# EAGLE schematic STM32L05C8T6 (EAGLE 9.6.2)
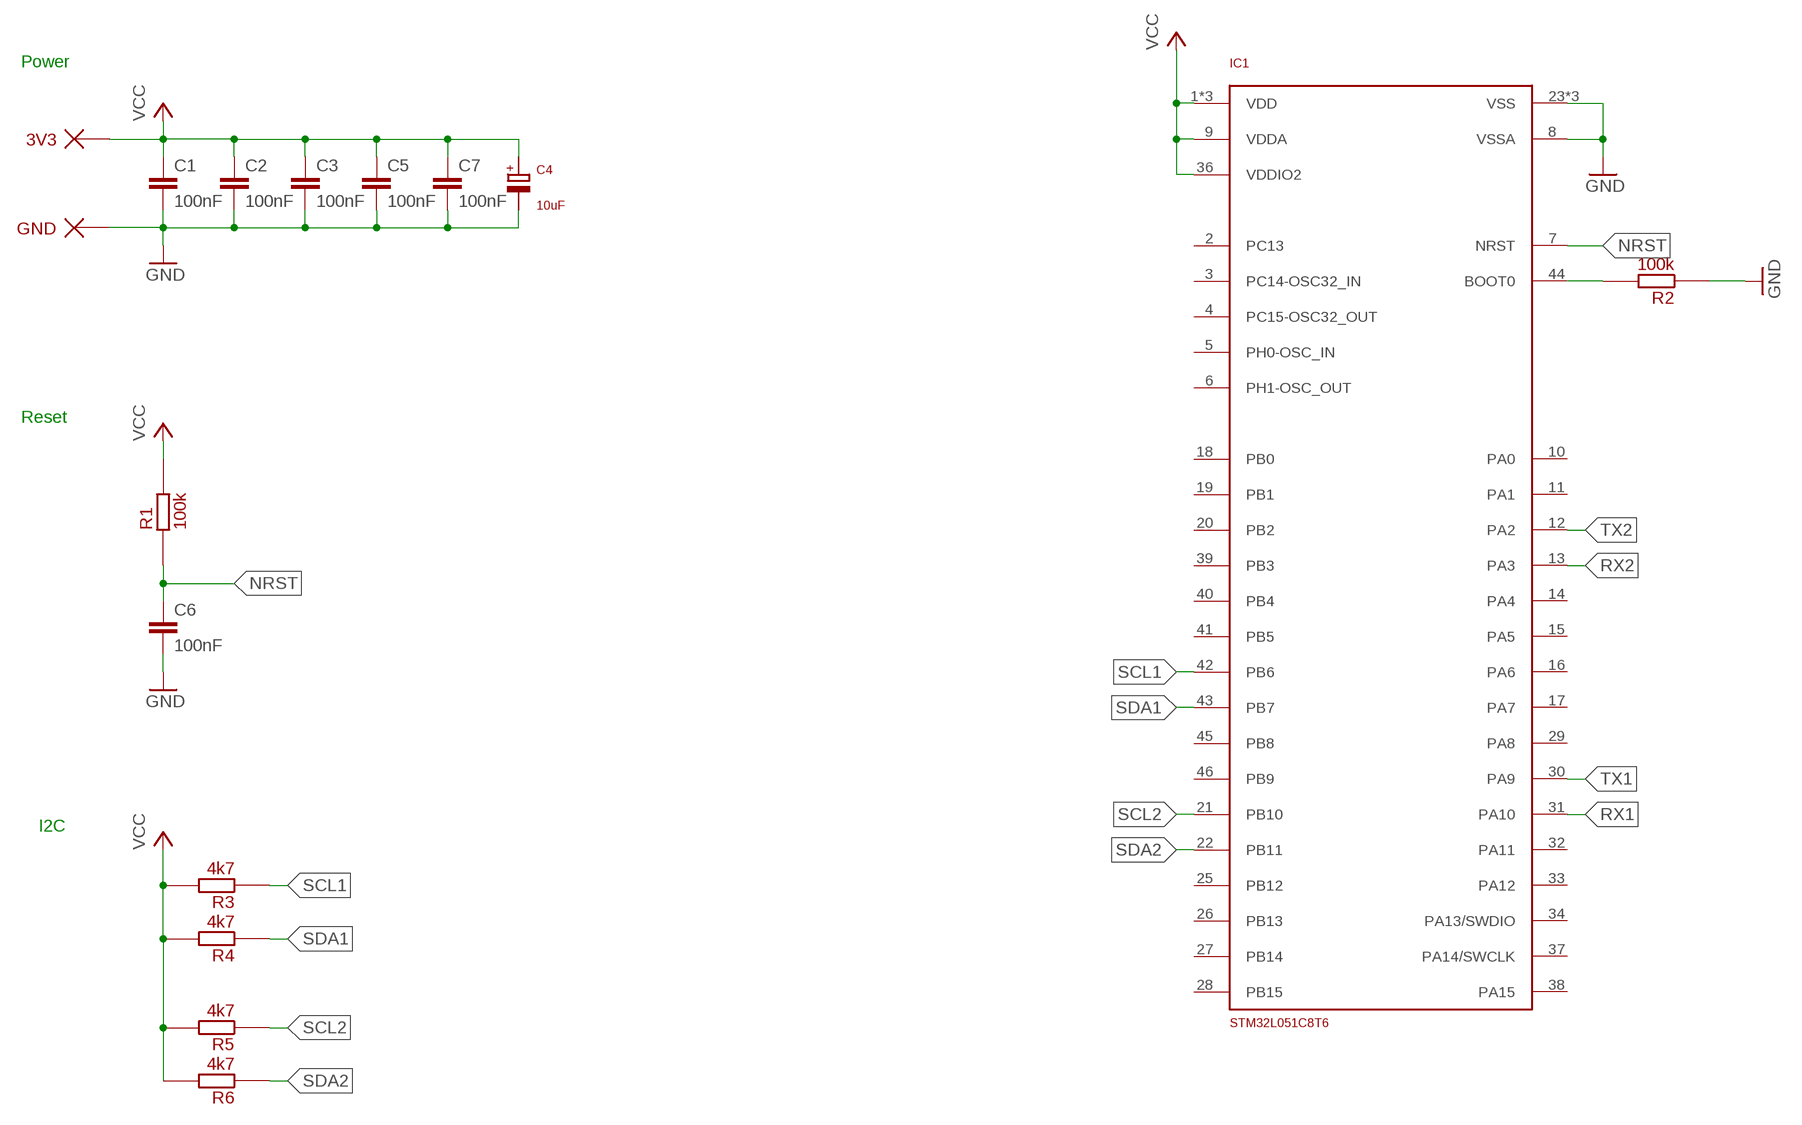
[diagram p0: schematic, sheet 1]

## Parts
C1  100nF  SMD-C-1206  [C1206]
C2  100nF  SMD-C-1206  [C1206]
C3  100nF  SMD-C-1206  [C1206]
C4  10uF  SMD-ELKOA5  [SANYO-OSCON_SMD_A5]
C5  100nF  SMD-C-1206  [C1206]
C6  100nF  SMD-C-1206  [C1206]
C7  100nF  SMD-C-1206  [C1206]
IC1  STM32L051C8T6  [TQFP48_7X7]
P1  3V3  PIN  [PIN]
P2  GND  PIN  [PIN]
R1  100k  SMD-RR0603  [R0603]
R2  100k  SMD-RR0603  [R0603]
R3  4k7  SMD-RR0603  [R0603]
R4  4k7  SMD-RR0603  [R0603]
R5  4k7  SMD-RR0603  [R0603]
R6  4k7  SMD-RR0603  [R0603]

## Nets
GND: C1.2 C2.2 C3.2 C4.- C5.2 C6.2 C7.2 IC1.8(VSSA) IC1.23(VSS) IC1.35(VSS) IC1.47(VSS) P2.P$1 R2.1
N$1: IC1.44(BOOT0) R2.2
NRST: C6.1 IC1.7(NRST) R1.1
RX1: IC1.31(PA10)
RX2: IC1.13(PA3)
SCL1: IC1.42(PB6) R3.1
SCL2: IC1.21(PB10) R5.1
SDA1: IC1.43(PB7) R4.1
SDA2: IC1.22(PB11) R6.1
TX1: IC1.30(PA9)
TX2: IC1.12(PA2)
VCC: C1.1 C2.1 C3.1 C4.+ C5.1 C7.1 IC1.1(VDD) IC1.9(VDDA) IC1.24(VDD) IC1.36(VDDIO2) IC1.48(VDD) P1.P$1 R1.2 R3.2 R4.2 R5.2 R6.2
Unconnected: IC1.2(PC13) IC1.3(PC14-OSC32_IN) IC1.4(PC15-OSC32_OUT) IC1.5(PH0-OSC_IN) IC1.6(PH1-OSC_OUT) IC1.10(PA0) IC1.11(PA1) IC1.14(PA4) IC1.15(PA5) IC1.16(PA6) IC1.17(PA7) IC1.18(PB0) IC1.19(PB1) IC1.20(PB2) IC1.25(PB12) IC1.26(PB13) IC1.27(PB14) IC1.28(PB15) IC1.29(PA8) IC1.32(PA11) IC1.33(PA12) IC1.34(PA13/SWDIO) IC1.37(PA14/SWCLK) IC1.38(PA15) IC1.39(PB3) IC1.40(PB4) IC1.41(PB5) IC1.45(PB8) IC1.46(PB9)

## Notes on the sheet
- Power
- Reset
- I2C

## Library data of the parts
C1-C3 C5-C7 = Standardbauteile:SMD-C-1206
C4 = Standardbauteile:SMD-ELKO
IC1 = Microcontroller:STM32L051C8T6
P1 P2 = Mechanik:PIN
R1-R6 = Standardbauteile:SMD-R